# Altium schematic sheet DigitalConverter.SchDoc
size A4; Organization: Altium Limited; Address1: L3, 12a Rodborough Rd; Address2: Frenchs Forest; Address3: NSW; Address4: Australia 2086
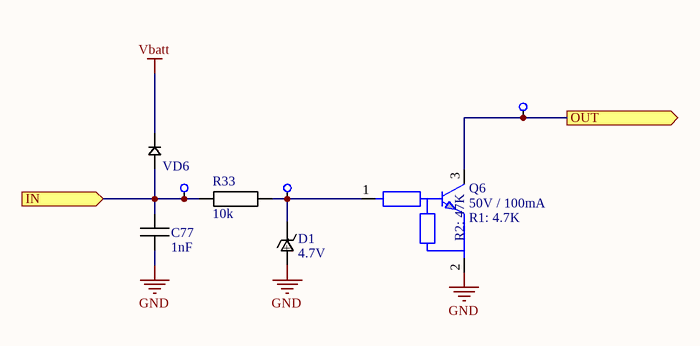
[diagram p0: DigitalConverter.SchDoc]

## Parts
C77  1nF  [SMD 0603]
D1  4.7V  [SOD323]
Q6  50V / 100mA  R1: 4.7K  R2: 47K  [SOT23]
R33  10k  [SMD 0603]
TP50  TestPoint  [TESTPOINT]  (value not drawn)
TP51  TestPoint  [TESTPOINT]  (value not drawn)
TP52  TestPoint  [TESTPOINT]  (value not drawn)
VD6  Diode  [SOD323]  (value not drawn)

## Ports
IN (in), OUT (out)

## Nets
GND: C77.1 D1.- Q6.2(E)
Vbatt: VD6.1
IN: C77.2 R33.1 TP50.0 VD6.0 ; port IN
OUT: Q6.3(C) TP52.0 ; port OUT
NetD1_+: D1.+ Q6.1(B) R33.2 TP51.0

## Notes on the sheet
- Title
- Size:
- Date:
- A4
- Number:
- Time:
- Revision:
- Sheet
- of
- File:

## Library data of the parts
C77 = Capasitor: CC0603KRX7R9BB102; Value: 1nF
D1 = Zener: BZX384-C4V7.115; pin to pad: +>1 ->2; value: 4.7V
Q6 = PDTC143ZT: NPN
R33 = Resistor: RC0603FR-0710KL; Value: 10k
VD6 = Diode: PMEG2020EJ.115; pin to pad: 0>2